# EAGLE design mobo-to-act-brd-flex-connector (EAGLE 9.6.2)
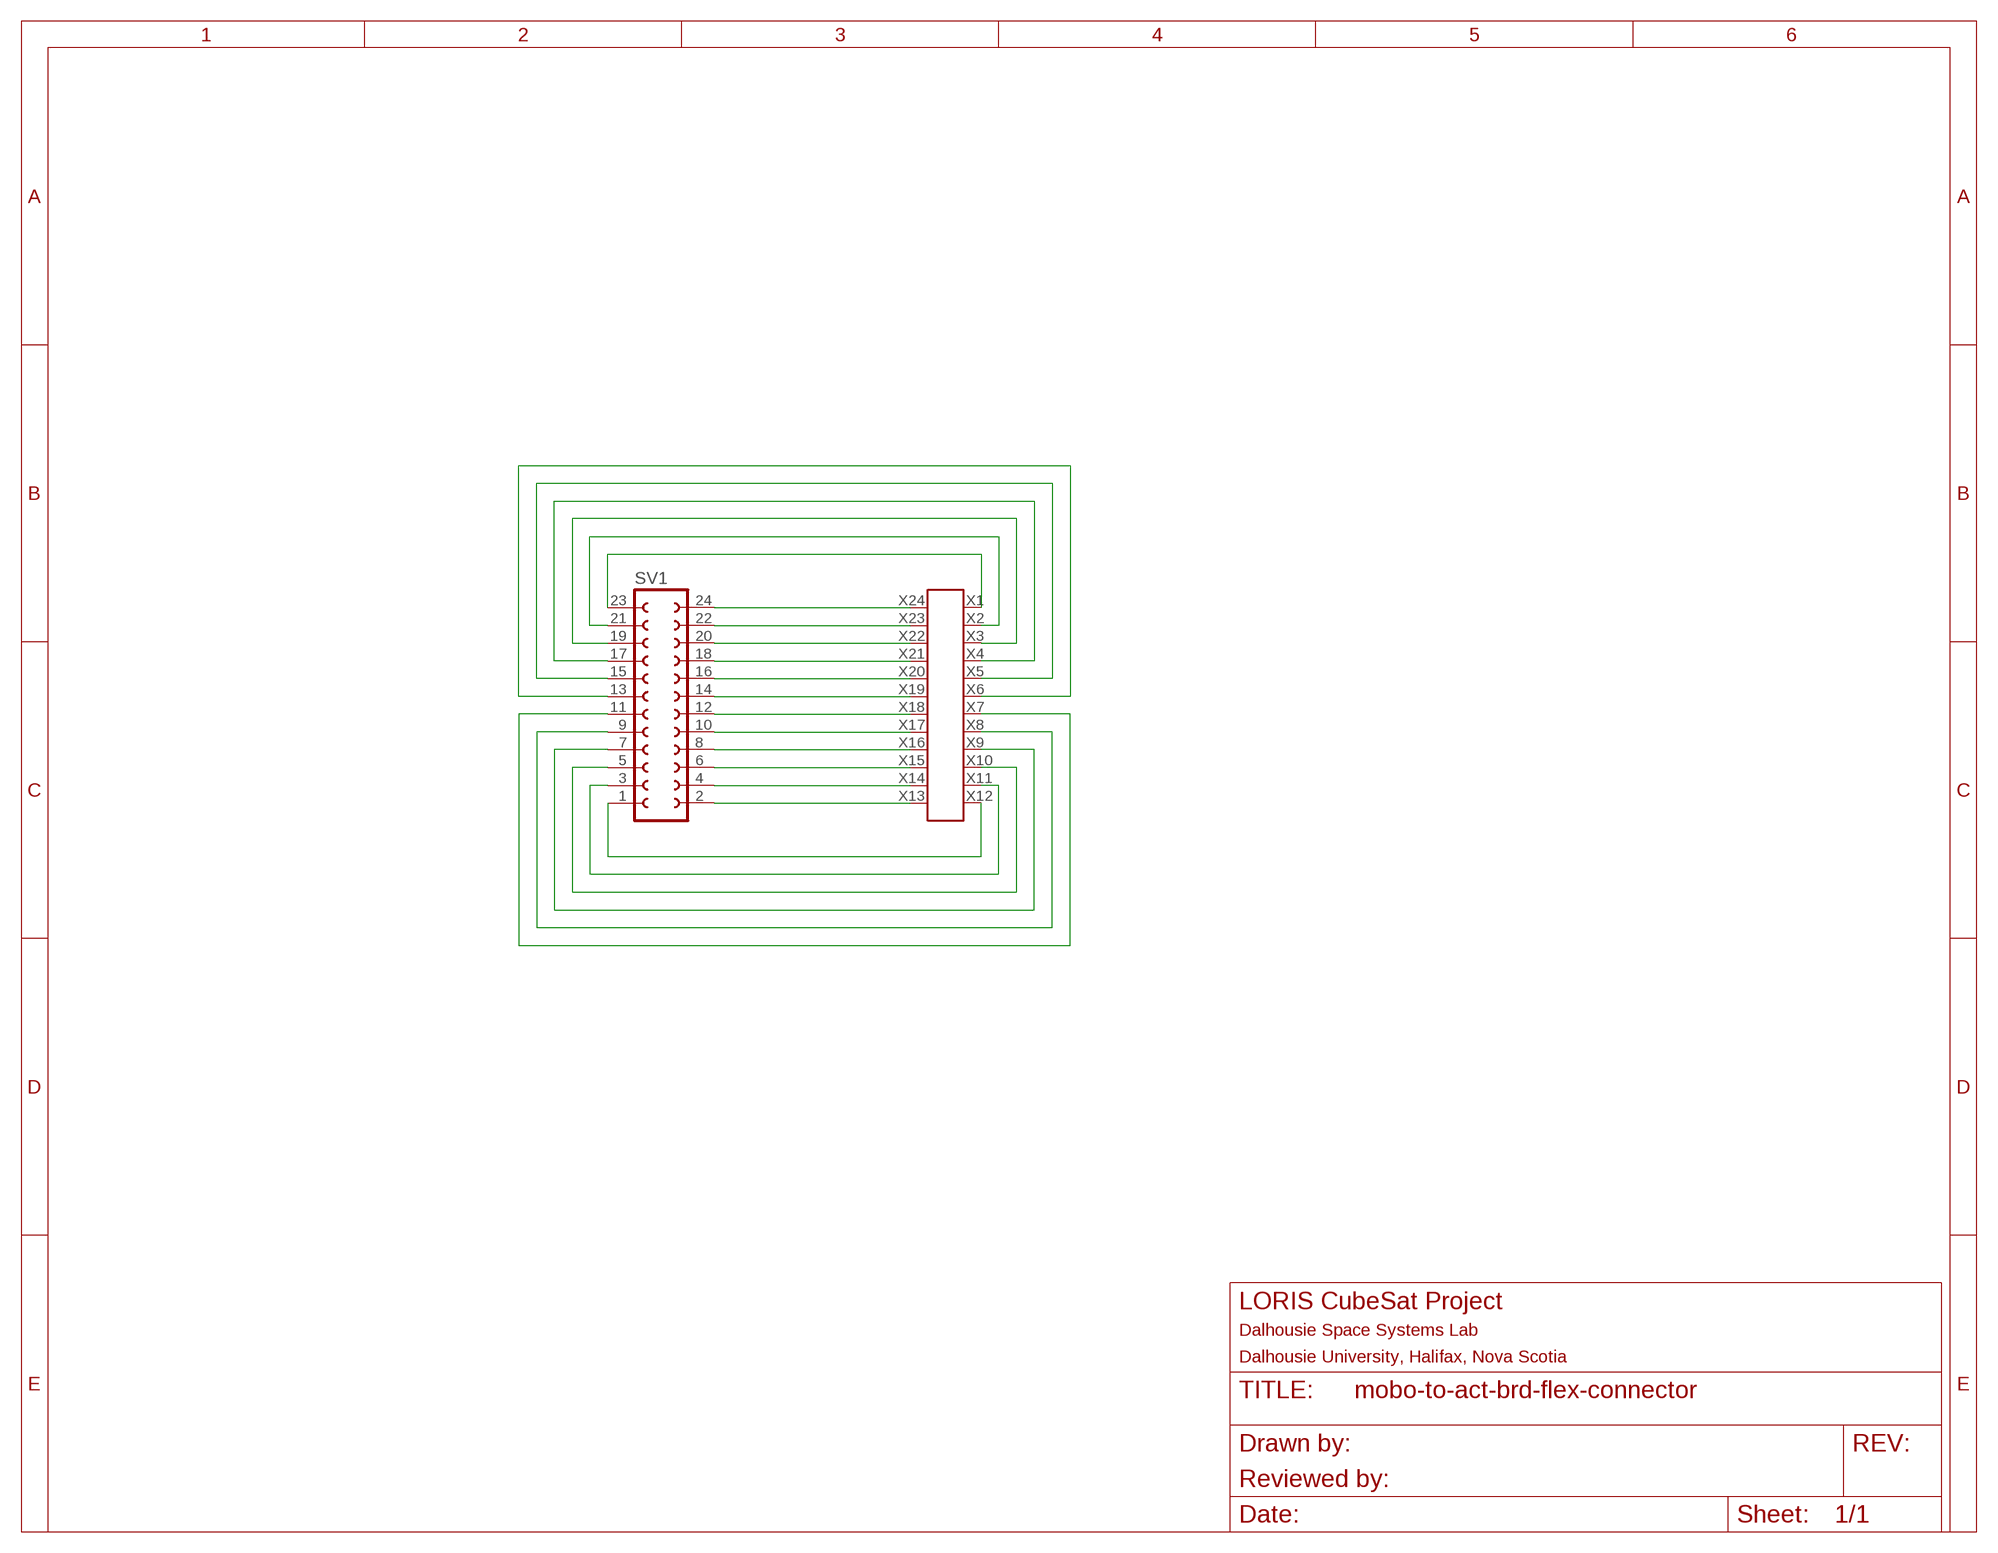
[diagram p0: schematic, sheet 1]

## Parts
SV1  FE12-2  [FE12-2]
U$2  12X2_SMD_2.54MM_HEADER  [12X2_HEADER]

## Nets
N$1: SV1.1 U$2.X12
N$2: SV1.23 U$2.X1
N$3: SV1.2 U$2.X13
N$4: SV1.4 U$2.X14
N$5: SV1.6 U$2.X15
N$6: SV1.8 U$2.X16
N$7: SV1.10 U$2.X17
N$8: SV1.12 U$2.X18
N$9: SV1.14 U$2.X19
N$10: SV1.16 U$2.X20
N$11: SV1.18 U$2.X21
N$12: SV1.20 U$2.X22
N$13: SV1.22 U$2.X23
N$14: SV1.24 U$2.X24
N$15: SV1.3 U$2.X11
N$16: SV1.5 U$2.X10
N$17: SV1.21 U$2.X2
N$18: SV1.19 U$2.X3
N$19: SV1.7 U$2.X9
N$20: SV1.17 U$2.X4
N$21: SV1.9 U$2.X8
N$22: SV1.15 U$2.X5
N$23: SV1.13 U$2.X6
N$24: SV1.11 U$2.X7

## Library data of the parts
SV1 = con-lsta:FE12-2: FEMALE HEADER; OC_FARNELL: unknown; OC_NEWARK: unknown
U$2 = SMD_headers:12X2_SMD_2.54MM_HEADER

## Board
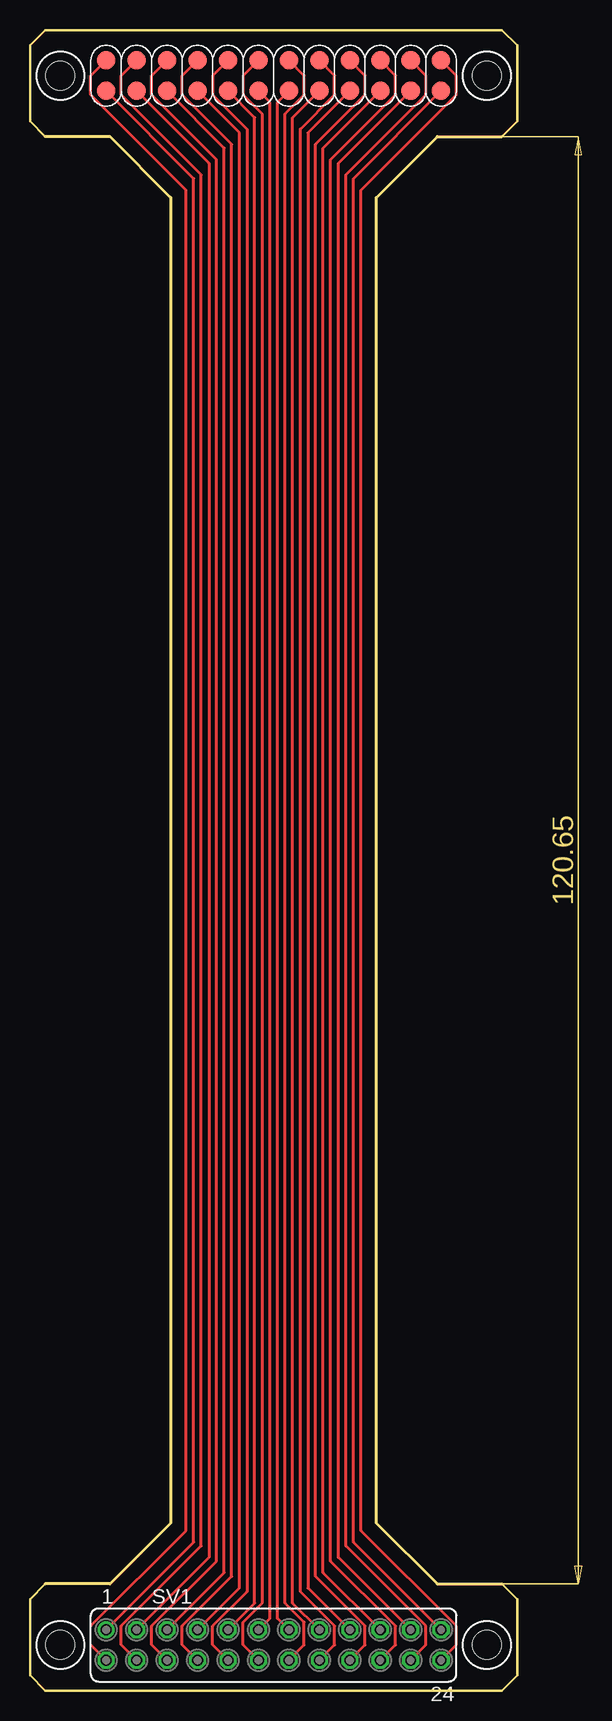
[diagram p1: board, top side]

Size 40.64 x 138.43 mm. Coordinates in mm from the lower left corner, seen from the top.
Outline: 0,7.62 0,1.27 1.27,0 39.37,0 40.64,1.27 40.64,7.62 39.37,8.89 33.97,8.89 28.89,13.97 28.89,124.46 33.97,129.54 39.37,129.54 40.64,130.81 40.64,137.16 39.37,138.43 1.27,138.43 0,137.16 0,130.81 1.27,129.54 6.67,129.54 11.75,124.46 11.75,13.97 6.67,8.89 1.27,8.89 0,7.62
Copper layers (1*16): Top 0.035mm / dielectric 1.5mm / Bottom 0.035mm
Design rules "default": minimum track width 6mil, minimum drill 0.35mm, track to track 6mil, track to pad 6mil, pad to pad 6mil, via to via 6mil, smd to smd 6mil, copper to edge 40mil, drill to drill 6mil, minimum pad ring 10mil, minimum via ring 8mil, stop-mask expansion 4mil, vias tented up to drill 0mil, thermal gap 10mil
Holes 2.4 mm at 2.54,3.81 38.1,3.81 2.54,134.62 38.1,134.62

### Footprints (pad centres in the part's own frame; a part is rotated, then mirrored left to right if it is on the bottom)
FE12-2 = drill 0.914: 1 -13.97,1.27 | drill 0.914 octagon: 2 -13.97,-1.27; 3 -11.43,1.27; 4 -11.43,-1.27; 5 -8.89,1.27; 6 -8.89,-1.27; 7 -6.35,1.27; 8 -6.35,-1.27; 9 -3.81,1.27; 10 -3.81,-1.27; 11 -1.27,1.27; 12 -1.27,-1.27; 13 1.27,1.27; 14 1.27,-1.27; 15 3.81,1.27; 16 3.81,-1.27; 17 6.35,1.27; 18 6.35,-1.27; 19 8.89,1.27; 20 8.89,-1.27; 21 11.43,1.27; 22 11.43,-1.27; 23 13.97,1.27; 24 13.97,-1.27
12X2_HEADER = smd 1.524 x 1.524: X1 13.97,-1.27; X2 11.43,-1.27; X3 8.89,-1.27; X4 6.35,-1.27; X5 3.81,-1.27; X6 1.27,-1.27; X7 -1.27,-1.27; X8 -3.81,-1.27; X9 -6.35,-1.27; X10 -8.89,-1.27; X11 -11.43,-1.27; X12 -13.97,-1.27; X13 -13.97,1.27; X14 -11.43,1.27; X15 -8.89,1.27; X16 -6.35,1.27; X17 -3.81,1.27; X18 -1.27,1.27; X19 1.27,1.27; X20 3.81,1.27; X21 6.35,1.27; X22 8.89,1.27; X23 11.43,1.27; X24 13.97,1.27

### Placement (x,y rotation side)
SV1  20.32,3.81 0 top
U$2  20.32,134.62 0 top

### Tracks (layer width: path | path; a pad name or v marks a point on that pad's centre or on a via)
N$1
  Top 0.254: SV1.1 13.65,12.38 13.65,126.05 U$2.X12
N$2
  Top 0.254: SV1.23 26.99,12.38 26.99,126.05 U$2.X1
N$3  (1 unrouted)
  Top 0.254: SV1.2 5.08,3.81 | 5.08,5.4 13.02,13.33 13.02,125.1 5.08,133.03 5.08,134.62 U$2.X13
N$4
  Top 0.254: SV1.4 7.62,3.81 7.62,5.4 14.29,12.06 14.29,126.36 7.62,133.03 7.62,134.62 U$2.X14
N$5
  Top 0.254: SV1.6 10.16,3.81 10.16,5.4 15.56,10.79 15.56,127.64 10.16,133.03 10.16,134.62 U$2.X15
N$6
  Top 0.254: SV1.8 12.7,3.81 12.7,5.4 16.83,9.53 16.83,128.91 12.7,133.03 12.7,134.62 U$2.X16
N$7
  Top 0.254: SV1.10 15.24,3.81 15.24,5.4 18.1,8.26 18.1,130.17 15.24,133.03 15.24,134.62 U$2.X17
N$8
  Top 0.254: SV1.12 17.78,3.81 17.78,5.71 19.37,7.3 19.37,131.44 17.78,133.03 17.78,134.62 U$2.X18
N$9
  Top 0.254: SV1.14 22.86,3.81 22.86,5.71 21.27,7.3 21.27,131.44 22.86,133.03 22.86,134.62 U$2.X19
N$10
  Top 0.254: SV1.16 25.4,3.81 25.4,5.4 22.54,8.26 22.54,130.17 25.4,133.03 25.4,134.62 U$2.X20
N$11
  Top 0.254: SV1.18 27.94,3.81 27.94,5.4 23.81,9.53 23.81,128.91 27.94,133.03 27.94,134.62 U$2.X21
N$12
  Top 0.254: SV1.20 30.48,3.81 30.48,5.4 25.08,10.79 25.08,127.64 30.48,133.03 30.48,134.62 U$2.X22
N$13
  Top 0.254: SV1.22 33.02,3.81 33.02,5.4 26.35,12.06 26.35,126.36 33.02,133.03 33.02,134.62 U$2.X23
N$14
  Top 0.254: SV1.24 35.56,3.81 35.56,5.4 27.62,13.33 27.62,125.1 35.56,133.03 35.56,134.62 U$2.X24
N$15
  Top 0.254: U$2.X11 14.92,127.32 14.92,11.11 SV1.3
N$16
  Top 0.254: SV1.5 16.19,9.84 16.19,128.59 U$2.X10
N$17
  Top 0.254: SV1.21 25.72,11.11 25.72,127.32 U$2.X2
N$18
  Top 0.254: SV1.19 24.45,9.84 24.45,128.59 U$2.X3
N$19
  Top 0.254: SV1.7 17.46,8.57 17.46,129.86 U$2.X9
N$20
  Top 0.254: U$2.X4 23.18,129.86 23.18,8.57 SV1.17
N$21
  Top 0.254: SV1.9 18.73,7.3 18.73,131.13 U$2.X8
N$22
  Top 0.254: SV1.15 21.91,7.3 21.91,131.13 U$2.X5
N$23
  Top 0.254: SV1.13 20.64,6.03 20.64,132.4 U$2.X6
N$24
  Top 0.254: SV1.11 20,6.03 20,132.4 U$2.X7

### Text on the board
Document: M2 screw clearance holes if required